# EAGLE design SensorBoard (EAGLE 9.2.0)
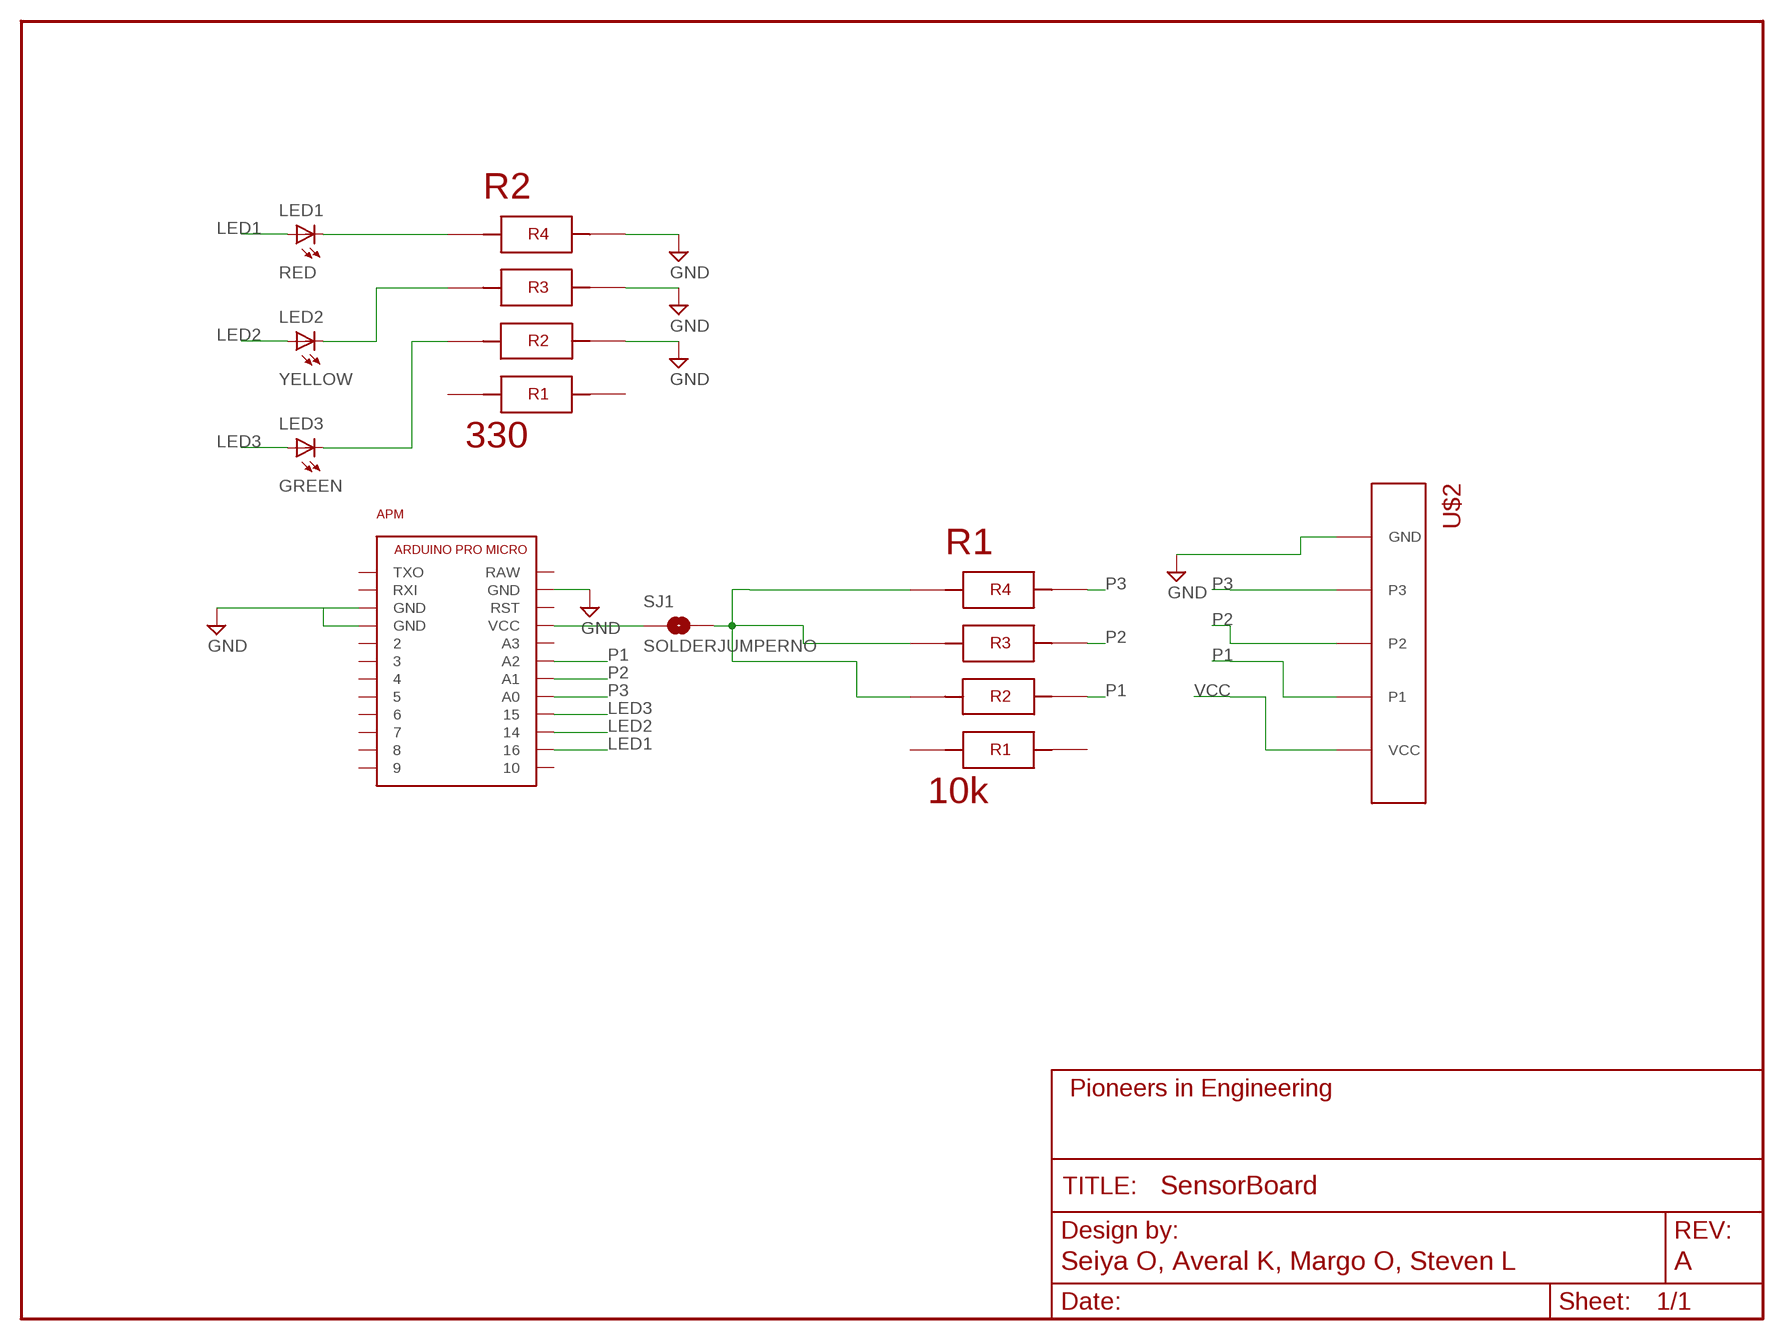
[diagram p0: schematic, sheet 1]
FRAME1 (FRAME_SCHEMATIC): AUTHOR: Seiya O, Averal K, Margo O, Steven L; REVISION: A

## Parts
APM  ARDUINO_PRO_MICRO  [ARDUINO_PRO_MICRO]
LED1  RED  LED1206  [LED-1206]
LED2  YELLOW  LED1206  [LED-1206]
LED3  GREEN  LED1206  [LED-1206]
R1  10k  4X-0603  [4X-0603]
R2  330  4X-0603  [4X-0603]
SJ1  SOLDERJUMPERNO  [SJ_2S-NO]
U$2  5PIN  [5PIN]

## Nets
5V: R1.5 R1.6 R1.7 SJ1.2
GND: APM.GND@0(GND) APM.GND@1(GND) APM.GND@2(GND) R2.2 R2.3 R2.4 U$2.GND
LED1: APM.16 LED1.A
LED2: APM.14 LED2.A
LED3: APM.15 LED3.A
N$1: LED2.C R2.6
N$2: LED1.C R2.5
N$6: LED3.C R2.7
P1: APM.A2 R1.2 U$2.P1
P2: APM.A1 R1.3 U$2.P2
P3: APM.A0 R1.4 U$2.P3
VCC: APM.VCC SJ1.1 U$2.VCC
Unconnected: APM.2 APM.3 APM.4 APM.5 APM.6 APM.7 APM.8 APM.9 APM.10 APM.A3 APM.RAW APM.RST APM.RXI APM.TXO R1.1 R1.8 R2.1 R2.8

## Library data of the parts
APM = pie:ARDUINO_PRO_MICRO: Arduino Pro Micro Electrical System Year 9's Smart Sensor Core Pin Outs <https://cdn.sparkfun.com/assets/9/c/3/c/4/523a1765757b7f5c6e8b4567.png> Buy Here <http://www.aliexpress.com/item/Mini-Leonardo-Pro-Micro-ATmega32U4-5V-16MHz-Module-For-Arduino-Best-Quality/32284746884.html?ws_ab_test=searchweb201556_8,searchweb201602_2_10057_10056_10065_10055_10054_10067_10069_10059_10058_10017_10070_10060_10061_10052_10062_10053_10050_10051,searchweb201603_1&btsid=45993952-29ca-4de4-a0fb-c7fb72b8e1a5> Thru Hole Female Pins <http://www.digikey.com/product-search/en?keywords=929974E-01-12-ND> Surface Mount Female Pins <http://www.digikey.com/product-detail/en/sullins-connector-solutions/NPTC121KFXC-RC/S5604-ND/776062>; DESCRIPTION: Arduino Pro Micro; DISTRIBUTOR: AliExpress; DISTRIBUTOR_PART_NUMBER: 32284746884; MANUFACTURER: Feiyang electronics; NOTES: https://www.aliexpress.com/item/Mini-Leonardo-Pro-Micro-ATmega32U4-5V-16MHz-Module-For-Arduino-Best-Quality/32284746884.html?ws_ab_test=searchweb201556_8,searchweb201602_2_10057_10056_10065_10055_10054_10067_10069_10059_10058_10017_10070_10060_10061_10052_10062_10053_10050_10051,searchweb201603_1&btsid=45993952-29ca-4de4-a0fb-c7fb72b8e1a5; PACKAGE: ARDUINO_PRO_MICRO; REFERENCE_DEST: ARDUINO_PRO_MICRO
LED1-LED3 = pie:LED: LEDs Standard schematic elements and footprints for 5mm, 3mm, 1206, and 0603 sized LEDs. 5mm - Spark Fun Electronics SKU : COM-00529 (and others); PIE-INT-REF-NUM: LED
R1 R2 = pie:4X-0603: 330: https://www.digikey.com/product-detail/en/panasonic-electronic-components/EXB-38V331JV/Y9331CT-ND/256586 10k: https://www.digikey.com/product-detail/en/panasonic-electronic-components/EXB-38V103JV/Y9103CT-ND/256604
SJ1 = pie:SOLDERJUMPER: Solder Jumper Standard SMD solder jumper. Used to automate production. Two varients : Normally Open and Normally Closed are the same, but have different paste layers. NC will have a large amount of paste and should jumper during reflow.; PIE-INT-REF-NUM: DNL
U$2 = pie:5PIN

## Board
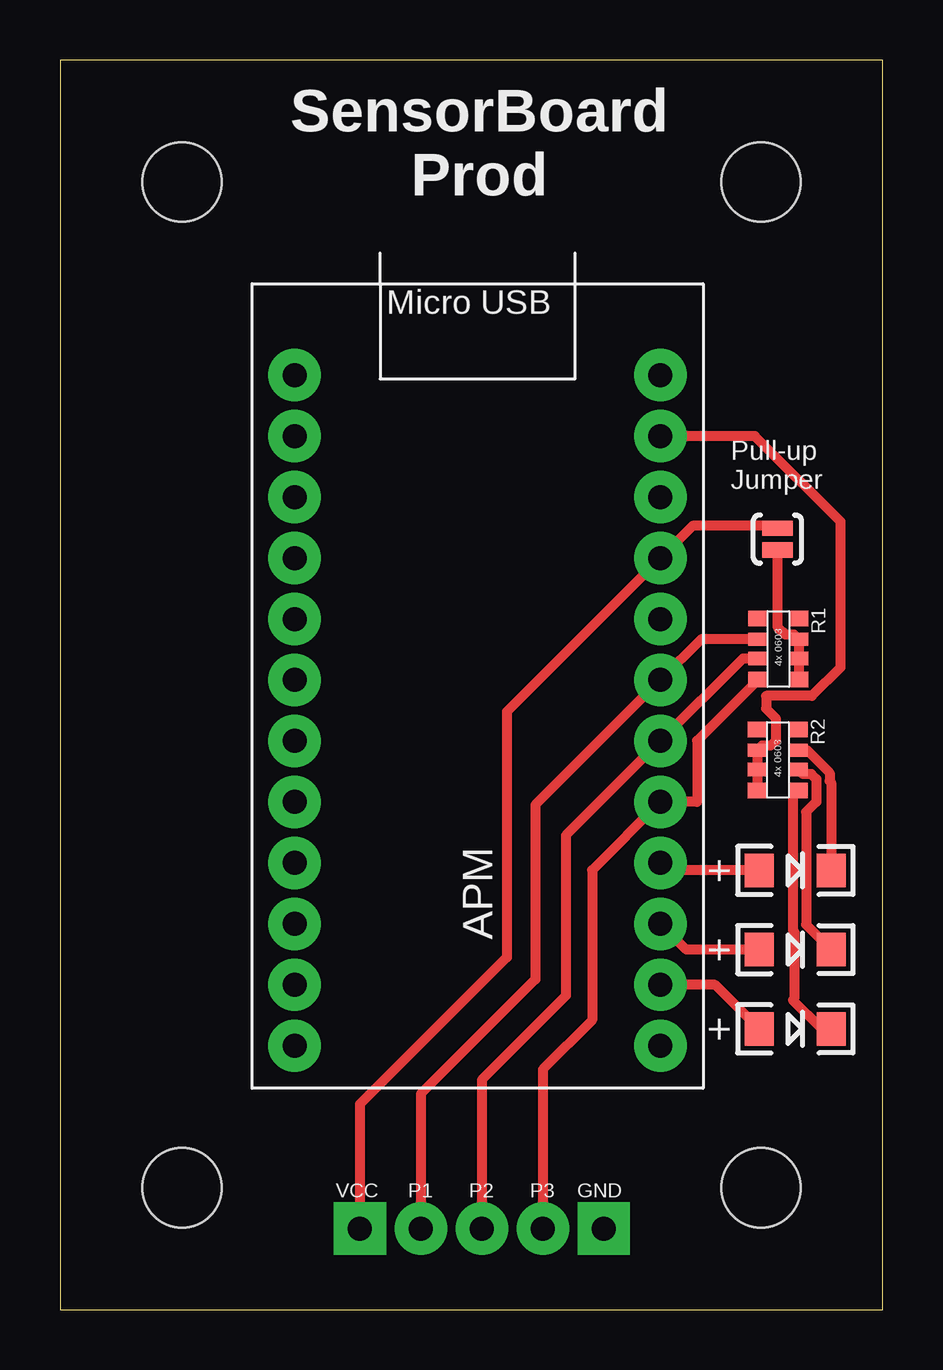
[diagram p1: board, top side]
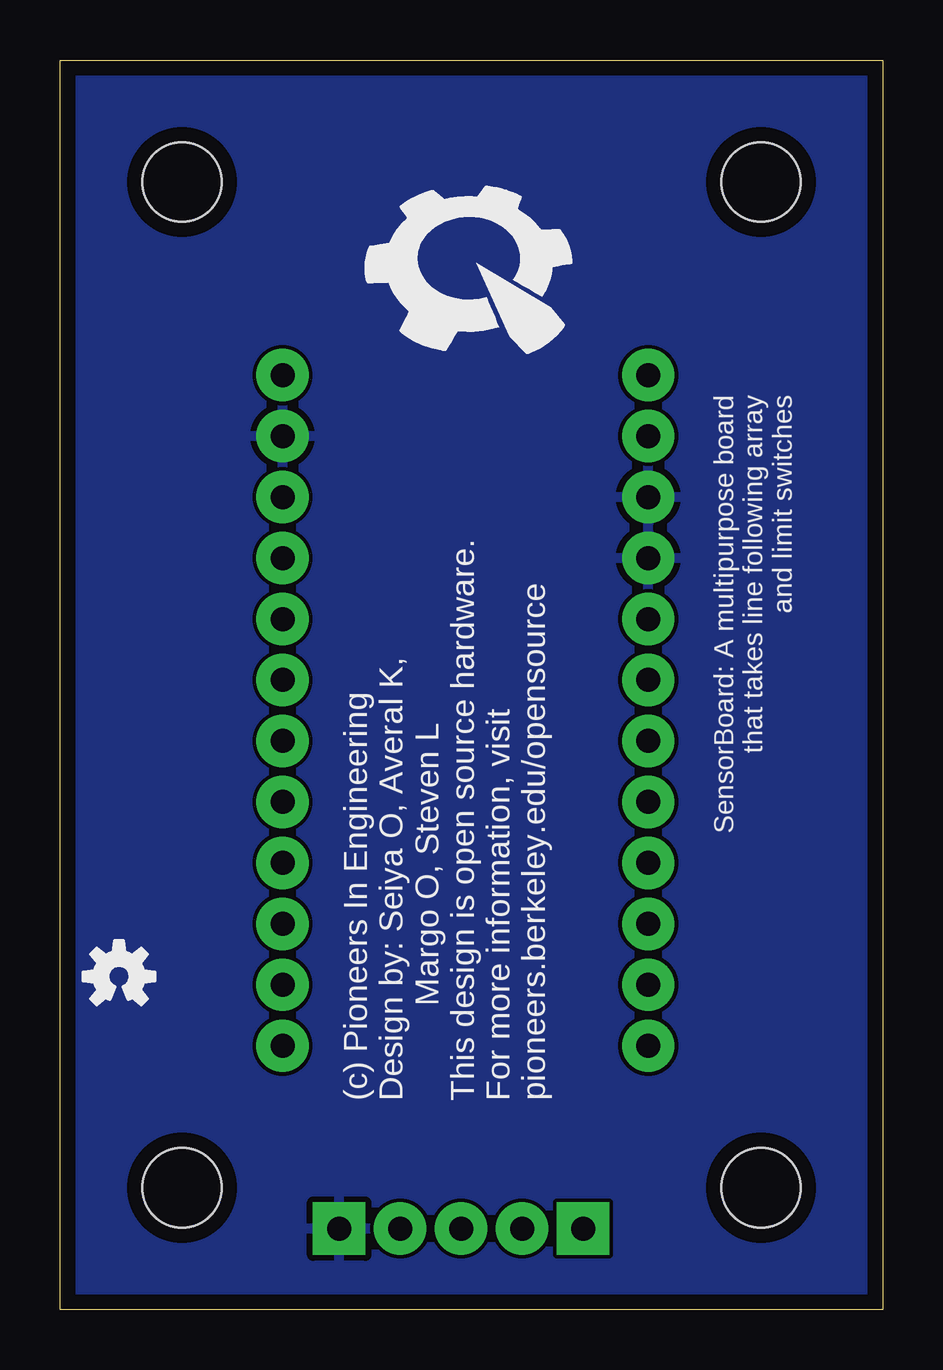
[diagram p2: board, bottom side, seen from below]

Size 34.29 x 52.07 mm. Coordinates in mm from the lower left corner, seen from the top.
Outline: 0,0 34.29,0 34.29,52.07 0,52.07 0,0
Copper layers (1*16): Top 2mil / dielectric 9mil / Bottom 2mil
Design rules "pie": minimum track width 6mil, minimum drill 15mil, track to track 6mil, track to pad 6mil, pad to pad 6mil, via to via 6mil, smd to smd 6mil, copper to edge 25mil, drill to drill 7mil, minimum pad ring 7mil, minimum via ring 7mil, stop-mask expansion 3mil, vias tented up to drill 21mil, thermal gap 10mil

### Footprints (pad centres in the part's own frame; a part is rotated, then mirrored left to right if it is on the bottom)
ARDUINO_PRO_MICRO = drill 1 pad 2.184: 2 1.778,19.558; 3 1.778,17.018; 4 1.778,14.478; 5 1.778,11.938; 6 1.778,9.398; 7 1.778,6.858; 8 1.778,4.318; 9 1.778,1.778; 10 17.018,1.778; 14 17.018,6.858; 15 17.018,9.398; 16 17.018,4.318; A0 17.018,11.938; A1 17.018,14.478; A2 17.018,17.018; A3 17.018,19.558; GND@0 1.778,24.638; GND@1 1.778,22.098; GND@2 17.018,27.178; RAW 17.018,29.718; RST 17.018,24.638; RXI 1.778,27.178; TXO 1.778,29.718; VCC 17.018,22.098
LED-1206 = smd 1.2 x 1.4: A -1.5,0; C 1.5,0
4X-0603 = smd 0.65 x 0.8: 1 0,-0.05; 4 2.55,-0.05; 5 2.55,1.65; 8 0,1.65 | smd 0.55 x 0.8: 2 0.875,-0.05; 3 1.675,-0.05; 6 1.675,1.65; 7 0.875,1.65
SJ_2S-NO = smd 0.635 x 1.27: 1 -0.45,0; 2 0.45,0
STAND-OFF = hole 3.302: 0,0
5PIN = drill 1 pad 2.184 square: GND 0,0; VCC 10.16,0 | drill 1 pad 2.184: P1 7.62,0; P2 5.08,0; P3 2.54,0

### Placement (x,y rotation side)
APM  8,9.22 0 top
LED1  30.63,11.7 0 top
LED2  30.63,15 0 top
LED3  30.63,18.3 0 top
R1  29.13,28.8 270 top
R2  29.11,24.18 270 top
SJ1  29.9,32.11 270 top
U$1  [STAND-OFF]  29.21,46.99 0 top
U$2  22.66,3.38 180 top
U$3  [PIE-LOGO-SMALL]  16.96,43.64 0 bottom
U$4  [OSHW-LOGO-S]  31.83,13.89 0 bottom
U$5  [STAND-OFF]  5.08,46.99 0 top
U$6  [STAND-OFF]  5.08,5.08 0 top
U$7  [STAND-OFF]  29.21,5.08 0 top

### Tracks (layer width: path | path; a pad name or v marks a point on that pad's centre or on a via)
5V
  Top 0.406: SJ1.2 29.9,28.46 30.24,28.12 30.59,28.12 R1.7 R1.6 R1.5
GND
  Top 0.406: APM.GND@2 28.96,36.4 32.51,32.84 32.51,26.75 31.33,25.57 29.42,25.57 29.42,25.05 29.81,24.65 29.81,23.71 29.61,23.5 29.25,23.5 R2.2 R2.3 R2.4
  pour Bottom: -0.3,52.4 34.14,52.4 34.14,-0.03 -0.3,-0.03
LED1
  Top 0.406: LED1.A 27.29,13.54 APM.16
LED2
  Top 0.406: LED2.A 26.09,15 APM.14
LED3
  Top 0.406: LED3.A 25.33,18.3 APM.15
N$1
  Top 0.406: LED2.C 31.09,16.04 31.09,20.74 31.51,21.16 31.51,22.1 31.31,22.31 30.95,22.31 R2.6
N$2
  Top 0.406: LED1.C 31.73,11.7 30.53,12.9 30.58,12.95 30.58,15.76 30.53,15.81 30.53,21.41 R2.5
N$6
  Top 0.406: LED3.C 32.13,21.96 32.07,22.02 32.07,22.37 31.14,23.31 R2.7
P1
  Top 0.406: R1.2 26.71,27.93 APM.A2 19.81,21.03 19.81,13.77 15.04,8.99 U$2.P1
P2
  Top 0.406: U$2.P2 17.58,9.58 21.08,13.08 21.08,19.76 APM.A1 28.45,27.13 R1.3
P3
  Top 0.406: U$2.P3 20.12,10.01 22.17,12.06 22.17,18.31 APM.A0 26.54,21.16 26.54,23.71 R1.4
VCC
  Top 0.406: SJ1.1 29.79,32.66 26.36,32.66 APM.VCC 18.62,24.92 18.62,14.68 12.5,8.56 U$2.VCC

### Text on the board
tPlace: SensorBoard / Prod
tNames: Pull-up / Jumper
bNames: SensorBoard: A multipurpose board / that takes line following array / and limit switches | (c) Pioneers In Engineering / Design by: Seiya O, Averal K, / Margo O, Steven L / This design is open source hardware. / For more information, visit / pioneers.berkeley.edu/opensource